# Altium schematic sheet AnalogBuffer.SchDoc
size A
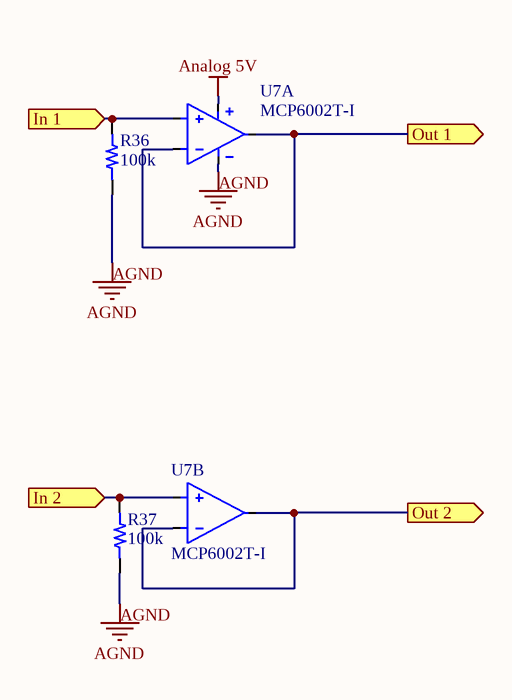
[diagram p0: AnalogBuffer.SchDoc]

## Parts
R36  resistance: 100k  [RES 0603/1608]  (hidden comment: resistor)
R37  resistance: 100k  [RES 0603/1608]  (hidden comment: resistor)
U7  MCP6002T-I  [SOIC-8]  (parts A,B of 2)

## Ports
In 1 (in), In 2 (in), Out 1 (out), Out 2 (out)

## Nets
AGND: R36.1 R37.1 U7.4(V-)
Analog 5V: U7.8(V+)
In 1: R36.2 U7.3(+IN_A) ; port In 1
In 2: R37.2 U7.5(+IN_B) ; port In 2
Out 1: U7.1(OUT_A) U7.2(-IN_A) ; port Out 1
Out 2: U7.6(-IN_B) U7.7(OUT_B) ; port Out 2

## Library data of the parts
R36 R37 = 1: id: 1; name: 0603 Resistor; percent tolerance: 5; package: 0603; quantity: 0
U7 = 2: Rail-to-Rail 2 Circuit OPAMP 8SOIC; id: 2; voltage: 6; slewrate: 0.600000023841858; gbw: 0; currentoutput: 23; voltagelow: 1.79999995231628; Name: MCP6002T-I; num_circuits: 2; voltagehigh: 6; quantity: 0; link: https://www.digikey.com/product-detail/en/microchip-technology/MCP6002T-I-SN/MCP6002T-I-SNCT-ND/4307905; createdby: Kevin